# Altium schematic sheet OSD.SchDoc
size A4; SheetNumber: 8; SheetTotal: 13
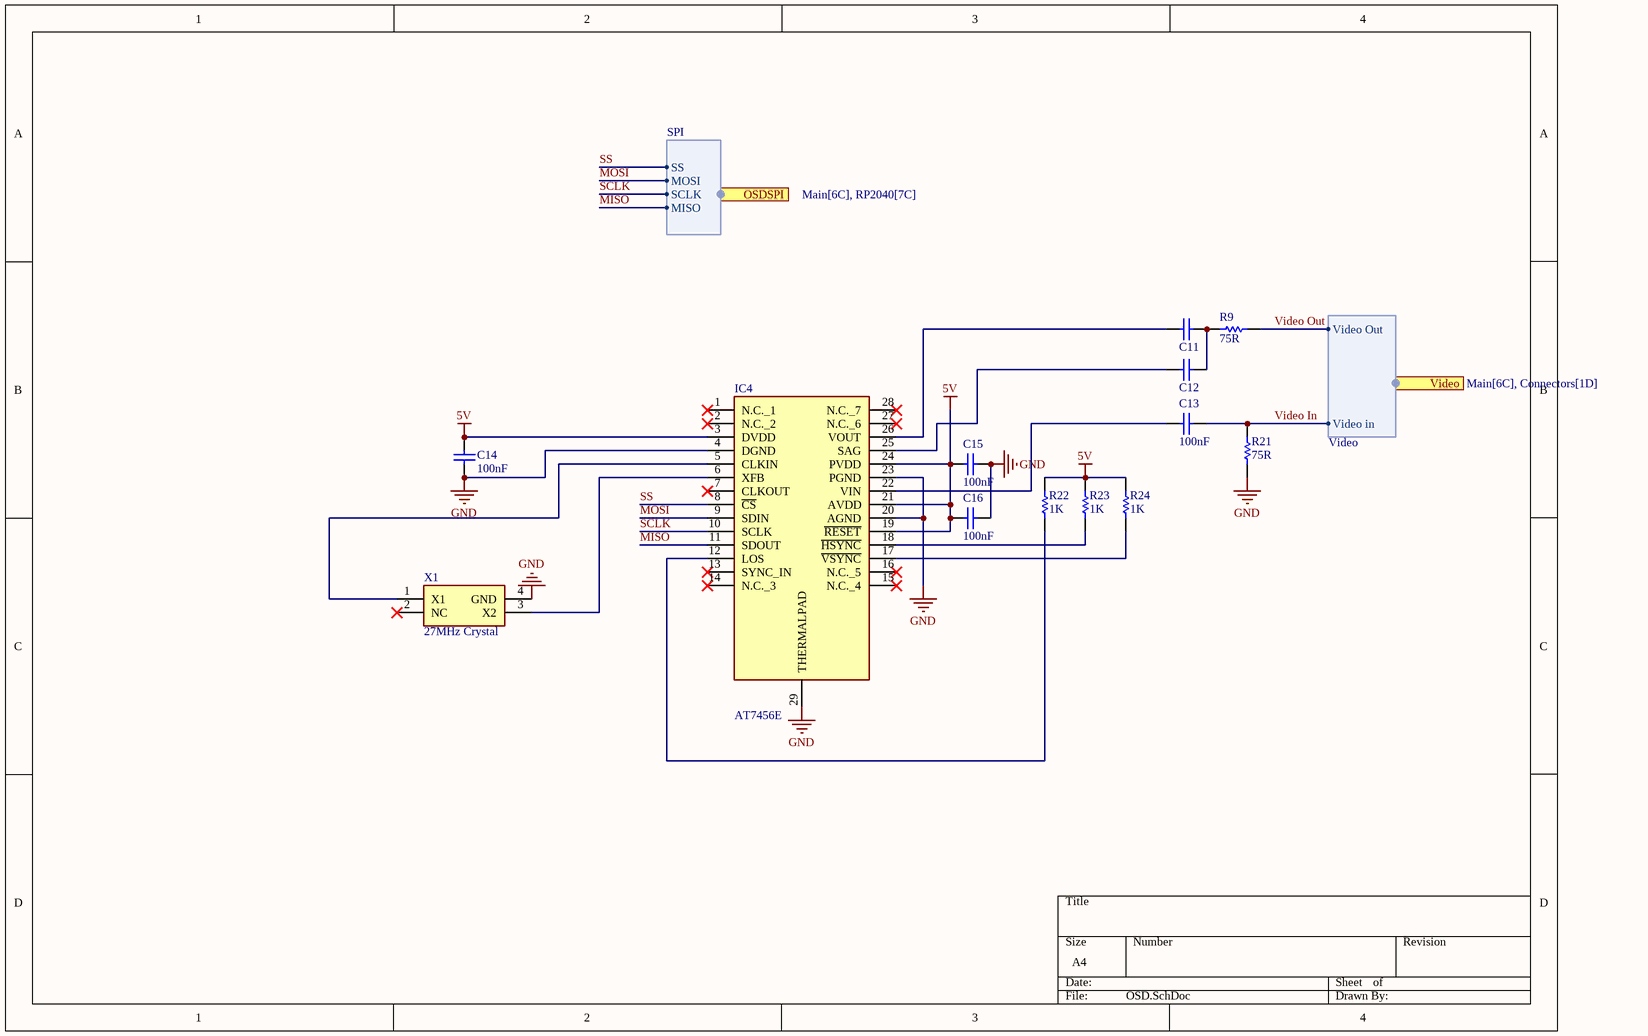
[diagram p0: OSD.SchDoc]

## Parts
C11  10µF  [WCAP-CSGP_0603_L1.6W0.8H0.8_Reflow]  (value not drawn)
C12  10µF  [WCAP-CSGP_0603_L1.6W0.8H0.8_Reflow]  (value not drawn)
C13  100nF  [0402 cap]
C14  100nF  [0402 cap]
C15  100nF  [0402 cap]
C16  100nF  [0402 cap]
IC4  AT7456E  [SOP65P640X120-29N]
R9  75R  [0402 resistor]
R21  75R  [0402 resistor]
R22  1K  [0402 resistor]
R23  1K  [0402 resistor]
R24  1K  [0402 resistor]
X1  27MHz Crystal  [1612 crystal]

## Ports
OSDSPI (harness SPI, see Main[6C], RP2040[7C]), Video (harness Video, see Main[6C], Connectors[1D])

## Harnesses
SPI: SS, MOSI, SCLK, MISO
Video: Video Out, Video in

## Nets
5V: C14.2 C15.1 C16.1 IC4.3(DVDD) IC4.19(~{RESET}) IC4.21(AVDD) IC4.24(PVDD) R22.2 R23.2 R24.2
GND: C14.1 C15.2 C16.2 IC4.4(DGND) IC4.20(AGND) IC4.23(PGND) IC4.29(THERMALPAD) R21.2 X1.4(GND)
MISO: IC4.11(SDOUT) ; port OSDSPI.MISO
MOSI: IC4.9(SDIN) ; port OSDSPI.MOSI
SCLK: IC4.10(SCLK) ; port OSDSPI.SCLK
SS: IC4.8(~{CS}) ; port OSDSPI.SS
Video In: C13.2 R21.1 ; port Video.Video in
Video Out: R9.1 ; port Video.Video Out
NetC11_1: C11.1 IC4.26(VOUT)
NetC11_2: C11.2 C12.2 R9.2
NetC12_1: C12.1 IC4.25(SAG)
NetC13_1: C13.1 IC4.22(VIN)
NetIC4_5: IC4.5(CLKIN) X1.1(X1)
NetIC4_6: IC4.6(XFB) X1.3(X2)
NetIC4_12: IC4.12(LOS) R22.1
NetIC4_17: IC4.17(~{VSYNC}) R24.1
NetIC4_18: IC4.18(~{HSYNC}) R23.1

Not connected (* = marked no-connect by the designer): IC4 1(N.C._1)* 2(N.C._2)* 7(CLKOUT)* 13(SYNC_IN)* 14(N.C._3)* 15(N.C._4)* 16(N.C._5)* 27(N.C._6)* 28(N.C._7)*; X1 2(NC)*

## Library data of the parts
C11 C12 = 885012106031: WCAP-CSGP Multilayer Ceramic Chip Capacitor, General Purpose, size 0603, X5R, 10µF, 25VDC; Manufacturer: Wurth Elektronik; Case/Size Code: 0603; Capacitance Tolerance: +/20%; Dissipation Factor: 20%; Insulation Resistance: 0.01GΩ; Rated Voltage (DC): 25V; Technical Reference: X5R0603106M025DFCT10000; ComponentLink1Description: Website Link; ComponentLink1URL: https://www.we-online.com/redexpert/article/885012106031?ad; ComponentLink2Description: Datasheet Link; ComponentLink2URL: https://www.we-online.com/redexpert/spec/885012106031?ad; Manufacturer Part Number: 885012106031; Category: Multilayer Ceramic Chip Capacitors; Match Code: WCAP-CSGP; Mount: Surface Mount; Operating Temperature Max: 85°C; Operating Temperature Min: -55°C; Packaging: Tape and Reel; Length: 1.6mm; Width: 0.8mm; Height: 0.8mm; Capacitance: 10µF; Ceramic Type: X5R
C13-C16 = Capacitor 0402 100nF: Value: 100nF
IC4 = AT7456E: Integrated Circuit; Manufacturer_Name: ICOF; Datasheet Link: https://datasheet.lcsc.com/szlcsc/ZHONGKEWEI-AT7456E_C82351.pdf; Height: 1.2mm; Manufacturer_Part_Number: AT7456E
R9 R21-R24 = Resistor 0402 1K
  R9 R21: Value: 75R
  R22-R24: Value: 1K
X1 = 1612 Crystal: HD 7E027000H01; Manufacturer_Name: Microchip; Manufacturer_Part_Number: DSC6003MA3B-032K768; Datasheet Link: https://www.mouser.es/datasheet/2/268/DSC60xxB-Ultra-Small-Ultra-Low-Power-MEMS-Oscillat-1660527.pdf; Height: 0.89mm; Mouser Part Number: 579-6003MA3B032K768; Mouser Price/Stock: https://www.mouser.co.uk/ProductDetail/Microchip-Technology/DSC6003MA3B-032K768?qs=PqoDHHvF64%252BWTEYTiC%2Fvdw%3D%3D